# EAGLE design PointhiBoard (EAGLE 6.5.0)
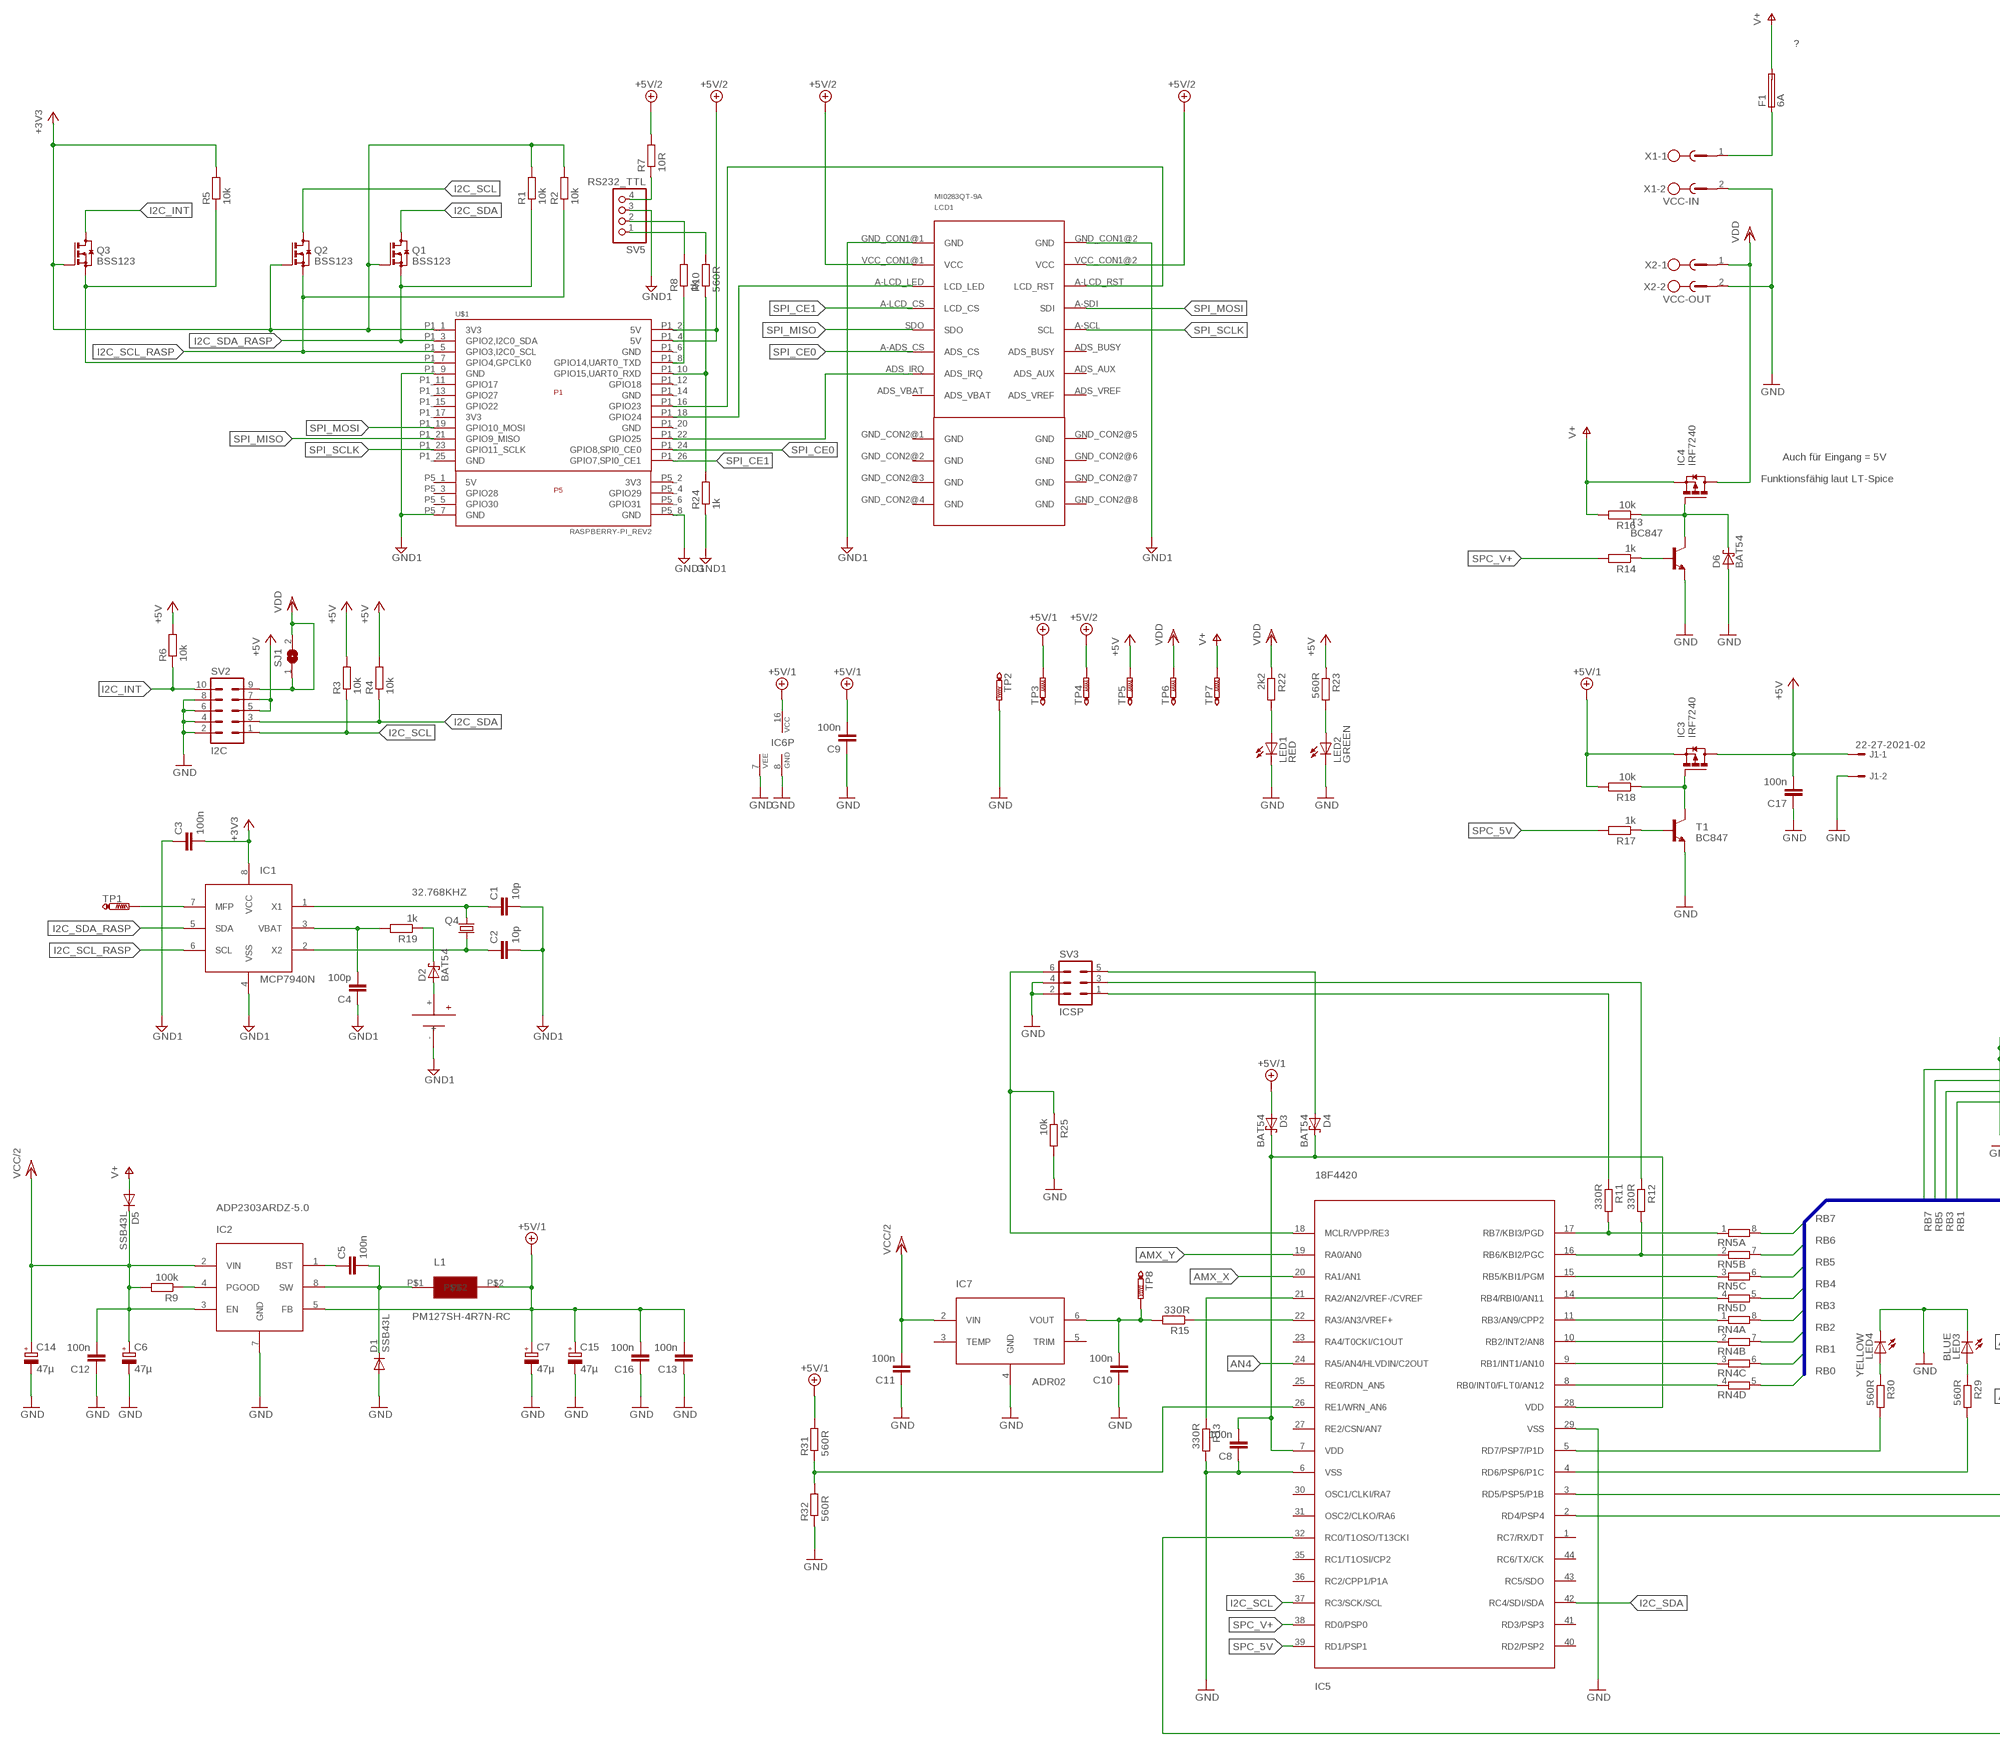
[diagram p0: schematic, sheet 1, part 1 of 2]
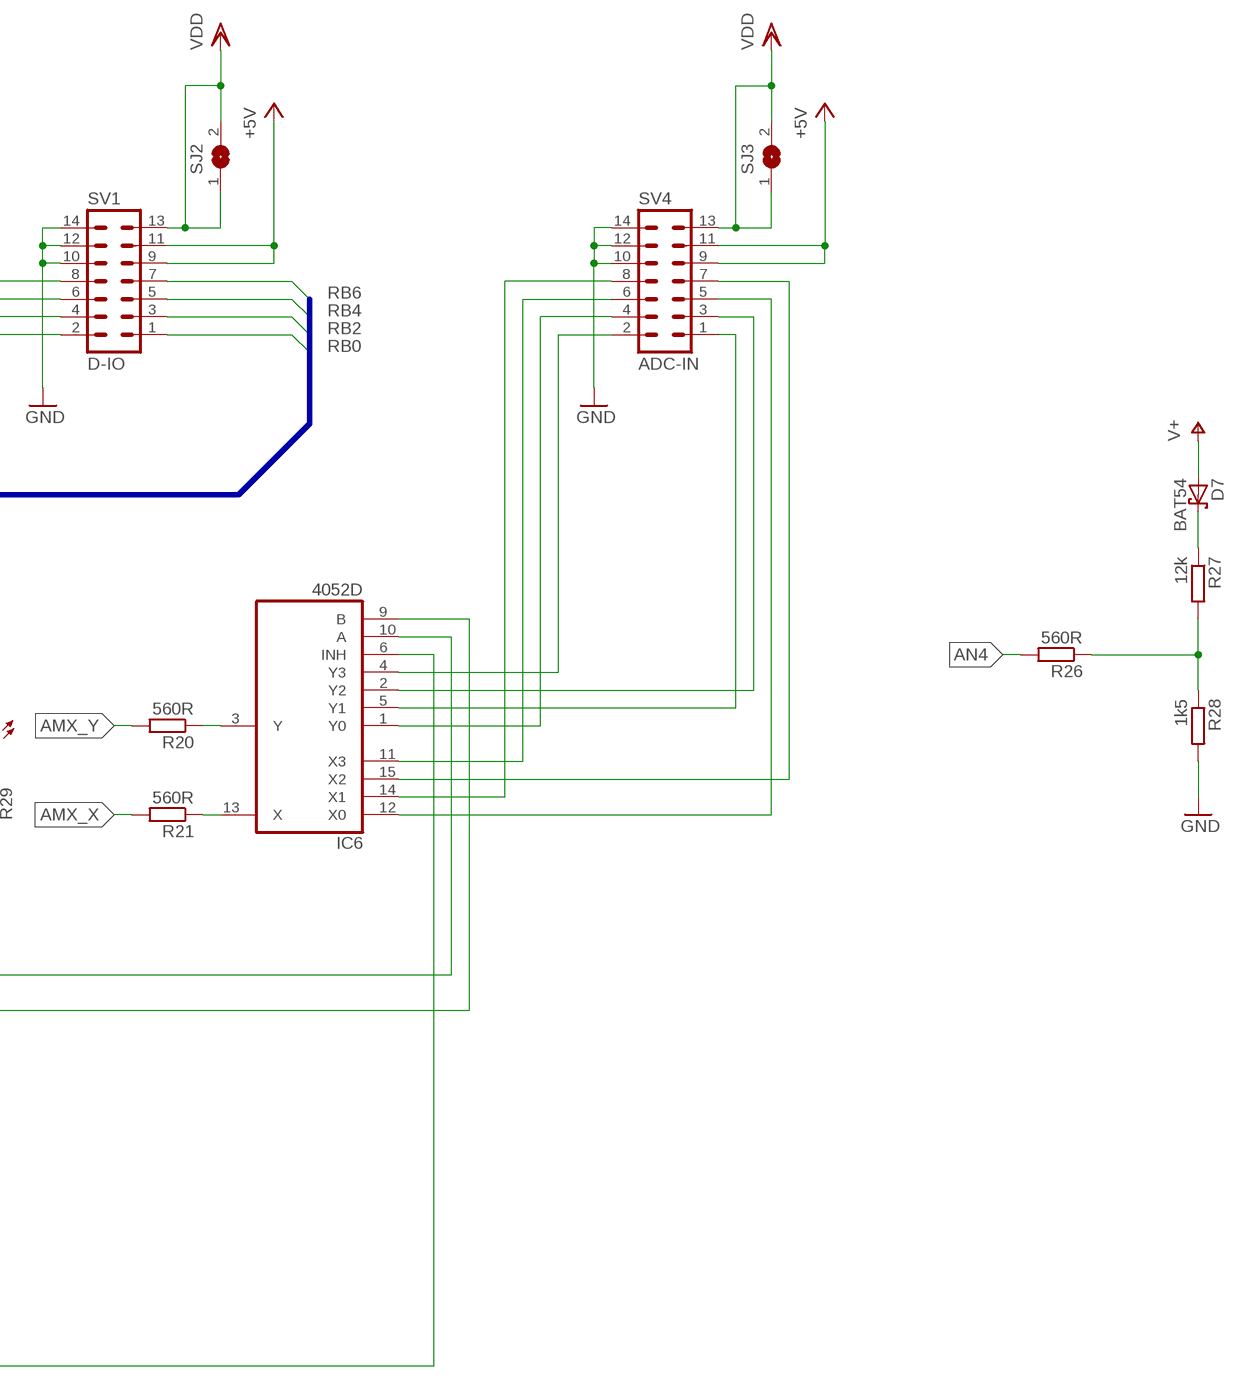
[diagram p1: schematic, sheet 1, part 2 of 2]

## Parts
BAT1  CH25-2032LF  [CH25-2032LF]
C1  10p  C-EUC0805  [C0805]
C2  10p  C-EUC0805  [C0805]
C3  100n  C-EUC0805  [C0805]
C4  100p  C-EUC0805  [C0805]
C5  100n  C-EUC0805  [C0805]
C6  47µ  CPOL-EUD  [PANASONIC_D]
C7  47µ  CPOL-EUD  [PANASONIC_D]
C8  100n  C-EUC0805  [C0805]
C9  100n  C-EUC0805  [C0805]
C10  100n  C-EUC0805  [C0805]
C11  100n  C-EUC0805  [C0805]
C12  100n  C-EUC0805  [C0805]
C13  100n  C-EUC0805  [C0805]
C14  47µ  CPOL-EUD  [PANASONIC_D]
C15  47µ  CPOL-EUD  [PANASONIC_D]
C16  100n  C-EUC0805  [C0805]
C17  100n  C-EUC0805  [C0805]
D1  SSB43L  DIODE-DO214AA  [DO214AA]
D2  BAT54  [SOT23]
D3  BAT54  [SOT23]
D4  BAT54  [SOT23]
D5  SSB43L  DIODE-DO214AA  [DO214AA]
D6  BAT54  [SOT23]
D7  BAT54  [SOT23]
F1  6A  FUSESHK20L  [SHK20L]
IC1  MCP7940N  MCP7940NMSOP8  [MSOP8]
IC2  ADP2303ARDZ-5.0  [SOIC8]
IC3  IRF7240  [SOIC8]
IC4  IRF7240  [SOIC8]
IC5  18F4420  PIC18F4420  [TQFP44]
IC6  4052D  [SO16]
IC7  ADR02  ADR0X  [SOIC8]
J1  22-27-2021-02  [6410-02]
L1  PM127SH-4R7N-RC  PM127SH  [PM127SH]
LCD1  MI0283QT-9A  MI0283QT_9A  [MI0283QT-9A]
LED1  RED  LEDCHIP-LED0805  [CHIP-LED0805]
LED2  GREEN  LEDCHIP-LED0805  [CHIP-LED0805]
LED3  BLUE  LEDCHIP-LED0805  [CHIP-LED0805]
LED4  YELLOW  LEDCHIP-LED0805  [CHIP-LED0805]
Q1  BSS123  [SOT23]
Q2  BSS123  [SOT23]
Q3  BSS123  [SOT23]
Q4  32.768KHZ  CRYSTALMM20SS  [MM20SS]
R1  10k  R-EU_R0805  [R0805]
R2  10k  R-EU_R0805  [R0805]
R3  10k  R-EU_R0805  [R0805]
R4  10k  R-EU_R0805  [R0805]
R5  10k  R-EU_R0805  [R0805]
R6  10k  R-EU_R0805  [R0805]
R7  10R  R-EU_R0805  [R0805]
R8  1k  R-EU_R0805  [R0805]
R9  100k  R-EU_R0805  [R0805]
R10  560R  R-EU_R0805  [R0805]
R11  330R  R-EU_R0805  [R0805]
R12  330R  R-EU_R0805  [R0805]
R13  330R  R-EU_R0805  [R0805]
R14  1k  R-EU_R0805  [R0805]
R15  330R  R-EU_R0805  [R0805]
R16  10k  R-EU_R0805  [R0805]
R17  1k  R-EU_R0805  [R0805]
R18  10k  R-EU_R0805  [R0805]
R19  1k  R-EU_R0805  [R0805]
R20  560R  R-EU_R0805  [R0805]
R21  560R  R-EU_R0805  [R0805]
R22  2k2  R-EU_R0805  [R0805]
R23  560R  R-EU_R0805  [R0805]
R24  1k  R-EU_R0805  [R0805]
R25  10k  R-EU_R0805  [R0805]
R26  560R  R-EU_R0805  [R0805]
R27  12k  R-EU_R0805  [R0805]
R28  1k5  R-EU_R0805  [R0805]
R29  560R  R-EU_R0805  [R0805]
R30  560R  R-EU_R0805  [R0805]
R31  560R  R-EU_R0805  [R0805]
R32  560R  R-EU_R0805  [R0805]
RN4  4R-NEXB38V  [EXB38V]
RN5  4R-NEXB38V  [EXB38V]
SJ1  SJ  [SJ]
SJ2  SJ  [SJ]
SJ3  SJ  [SJ]
SV1  D-IO  ML14-3ML  [3M_14L]
SV2  I2C  ML10-3ML  [3M_10L]
SV3  ICSP  ML6  [ML6]
SV4  ADC-IN  ML14-3ML  [3M_14L]
SV5  RS232_TTL  PINHD-1X4  [1X04]
T1  BC847  [SOT23]
T3  BC847  [SOT23]
TP1  PTR1B2,54  [B2,54]
TP2  PTR1B2,54  [B2,54]
TP3  PTR1B2,54  [B2,54]
TP4  PTR1B2,54  [B2,54]
TP5  PTR1B2,54  [B2,54]
TP6  PTR1B2,54  [B2,54]
TP7  PTR1B2,54  [B2,54]
TP8  PTR1B2,54  [B2,54]
U$1  RASPBERRY-PI_REV2  [RASPBERRY-PI_REV2]
X1  VCC-IN  MSTBV2  [MSTBV2]
X2  VCC-OUT  MSTBV2  [MSTBV2]

## Nets
+3V3: C3.2 IC1.8(VCC) Q1.1(G) Q2.1(G) Q3.1(G) R1.2 R2.2 R5.2 U$1.P1_1(3V3)
+5V: C17.2 IC3.5(D) IC3.6(D) IC3.7(D) IC3.8(D) J1.1 R3.2 R4.2 R6.2 R23.1 SV1.9 SV1.11 SV2.5 SV2.7 SV4.9 SV4.11 TP5.TP
+5V/1: C7.+ C9.2 C13.2 C15.+ C16.2 D3.1(A) IC2.5(FB) IC3.1(S) IC3.2(S) IC3.3(S) IC6.16(VCC) L1.P$2 R18.2 R31.2 TP3.TP
+5V/2: LCD1.VCC_CON1@1(VCC) LCD1.VCC_CON1@2(VCC) R7.2 TP4.TP U$1.P1_2(5V) U$1.P1_4(5V)
AMX_X: IC5.20(RA1/AN1) R21.2
AMX_Y: IC5.19(RA0/AN0) R20.2
AN4: IC5.24(RA5/AN4/HLVDIN/C2OUT) R26.2
GND: C6.- C7.- C8.1 C9.1 C10.1 C11.1 C12.1 C13.1 C14.- C15.- C16.1 C17.1 D1.A D6.1(A) IC2.7(GND) IC5.6(VSS) IC5.29(VSS) IC6.7(VEE) IC6.8(GND) IC7.4(GND) J1.2 LED1.C LED2.C LED3.C LED4.C R13.2 R25.2 R28.2 R32.1 SV1.10 SV1.12 SV1.14 SV2.2 SV2.4 SV2.6 SV2.8 SV3.2 SV3.4 SV4.10 SV4.12 SV4.14 T1.2(E) T3.2(E) TP2.TP X1.2 X2.2
GND1: BAT1.- C1.2 C2.2 C3.1 C4.1 IC1.4(VSS) LCD1.GND_CON1@1(GND) LCD1.GND_CON1@2(GND) R24.1 SV5.3 U$1.P1_9(GND) U$1.P5_7(GND) U$1.P5_8(GND)
I2C_INT: Q3.3(D) R6.1 SV2.10
I2C_SCL: IC5.37(RC3/SCK/SCL) Q2.3(D) R3.1 SV2.1
I2C_SCL_RASP: IC1.6(SCL) Q2.2(S) R2.1 U$1.P1_5(GPIO3,I2C0_SCL)
I2C_SDA: IC5.42(RC4/SDI/SDA) Q1.3(D) R4.1 SV2.3
I2C_SDA_RASP: IC1.5(SDA) Q1.2(S) R1.1 U$1.P1_3(GPIO2,I2C0_SDA)
MCLR: IC5.18(MCLR/VPP/RE3) R25.1 SV3.6
N$2: Q3.2(S) R5.1 U$1.P1_7(GPIO4,GPCLK0)
N$5: LCD1.A-LCD_LED(LCD_LED) U$1.P1_18(GPIO24)
N$6: LCD1.A-LCD_RST(LCD_RST) U$1.P1_16(GPIO23)
N$7: LCD1.ADS_IRQ U$1.P1_22(GPIO25)
N$8: R7.1 SV5.4
N$9: R8.1 U$1.P1_8(GPIO14,UART0_TXD)
N$10: R8.2 SV5.2
N$11: C5.2 D1.C IC2.8(SW) L1.P$1
N$12: C8.2 D3.3(C) D4.3(C) IC5.7(VDD) IC5.28(VDD)
N$13: C5.1 IC2.1(BST)
N$14: IC2.4(PGOOD) R9.1
N$15: IC5.17(RB7/KBI3/PGD) R11.2 RN5.1
N$16: IC5.16(RB6/KBI2/PGC) R12.2 RN5.2
N$17: C1.1 IC1.1(X1) Q4.1
N$18: C2.1 IC1.2(X2) Q4.4
N$19: D6.3(C) IC4.4(G) R16.1 T3.3(C)
N$20: R14.1 T3.1(B)
N$21: IC1.7(MFP) TP1.TP
N$22: IC5.15(RB5/KBI1/PGM) RN5.3
N$23: IC3.4(G) R18.1 T1.3(C)
N$24: R17.1 T1.1(B)
N$25: IC5.14(RB4/RBI0/AN11) RN5.4
N$26: IC5.11(RB3/AN9/CPP2) RN4.1
N$27: F1.1A X1.1
N$28: IC5.10(RB2/INT2/AN8) RN4.2
N$29: IC5.9(RB1/INT1/AN10) RN4.3
N$30: IC5.8(RB0/INT0/FLT0/AN12) RN4.4
N$31: D4.1(A) SV3.5
N$32: C4.2 IC1.3(VBAT) R19.2
N$33: BAT1.+ D2.1(A)
N$34: D2.3(C) R19.1
N$35: D7.3(C) R27.1
N$36: R11.1 SV3.1
N$37: R12.1 SV3.3
N$38: IC6.1(Y0) SV4.4
N$39: IC6.2(Y2) SV4.3
N$40: IC6.4(Y3) SV4.2
N$41: IC6.5(Y1) SV4.1
N$42: IC6.15(X2) SV4.7
N$43: IC6.14(X1) SV4.8
N$44: IC6.12(X0) SV4.5
N$45: IC6.11(X3) SV4.6
N$46: IC5.3(RD5/PSP5/P1B) IC6.10(A)
N$47: IC5.2(RD4/PSP4) IC6.9(B)
N$48: IC5.32(RC0/T1OSO/T13CKI) IC6.6(INH)
N$49: C10.2 IC7.6(VOUT) R15.2 TP8.TP
N$50: IC5.22(RA3/AN3/VREF+) R15.1
N$51: IC5.21(RA2/AN2/VREF-/CVREF) R13.1
N$52: IC6.13(X) R21.1
N$53: IC6.3(Y) R20.1
N$54: LED1.A R22.2
N$55: LED2.A R23.2
N$56: R10.1 R24.2 U$1.P1_10(GPIO15,UART0_RXD)
N$57: R10.2 SV5.1
N$58: R26.1 R27.2 R28.1
N$59: IC5.4(RD6/PSP6/P1C) R29.2
N$60: IC5.26(RE1/WRN_AN6) R31.1 R32.2
N$61: IC5.5(RD7/PSP7/P1D) R30.2
N$62: LED3.A R29.1
N$63: LED4.A R30.1
RB0: RN4.5 SV1.1
RB1: RN4.6 SV1.2
RB2: RN4.7 SV1.3
RB3: RN4.8 SV1.4
RB4: RN5.5 SV1.5
RB5: RN5.6 SV1.6
RB6: RN5.7 SV1.7
RB7: RN5.8 SV1.8
SPC_5V: IC5.39(RD1/PSP1) R17.2
SPC_V+: IC5.38(RD0/PSP0) R14.2
SPI_CE0: LCD1.A-ADS_CS(ADS_CS) U$1.P1_24(GPIO8,SPI0_CE0)
SPI_CE1: LCD1.A-LCD_CS(LCD_CS) U$1.P1_26(GPIO7,SPI0_CE1)
SPI_MISO: LCD1.SDO U$1.P1_21(GPIO9_MISO)
SPI_MOSI: LCD1.A-SDI(SDI) U$1.P1_19(GPIO10_MOSI)
SPI_SCLK: LCD1.A-SCL(SCL) U$1.P1_23(GPIO11_SCLK)
V+: D5.A D7.1(A) F1.2A IC4.1(S) IC4.2(S) IC4.3(S) R16.2 TP7.TP
VCC/2: C6.+ C11.2 C12.2 C14.+ D5.C IC2.2(VIN) IC2.3(EN) IC7.2(VIN) R9.2
VDD: IC4.5(D) IC4.6(D) IC4.7(D) IC4.8(D) R22.1 SJ1.1 SJ1.2 SJ2.1 SJ2.2 SJ3.1 SJ3.2 SV1.13 SV2.9 SV4.13 TP6.TP X2.1
Unconnected: IC5.1(RC7/RX/DT) IC5.23(RA4/T0CKI/C1OUT) IC5.25(RE0/RDN_AN5) IC5.27(RE2/CSN/AN7) IC5.30(OSC1/CLKI/RA7) IC5.31(OSC2/CLKO/RA6) IC5.35(RC1/T1OSI/CP2) IC5.36(RC2/CPP1/P1A) IC5.40(RD2/PSP2) IC5.41(RD3/PSP3) IC5.43(RC5/SDO) IC5.44(RC6/TX/CK) IC7.3(TEMP) IC7.5(TRIM) LCD1.ADS_AUX LCD1.ADS_BUSY LCD1.ADS_VBAT LCD1.ADS_VREF LCD1.GND_CON2@1(GND) LCD1.GND_CON2@2(GND) LCD1.GND_CON2@3(GND) LCD1.GND_CON2@4(GND) LCD1.GND_CON2@5(GND) LCD1.GND_CON2@6(GND) LCD1.GND_CON2@7(GND) LCD1.GND_CON2@8(GND) U$1.P1_6(GND) U$1.P1_11(GPIO17) U$1.P1_12(GPIO18) U$1.P1_13(GPIO27) U$1.P1_14(GND) U$1.P1_15(GPIO22) U$1.P1_17(3V3) U$1.P1_20(GND) U$1.P1_25(GND) U$1.P5_1(5V) U$1.P5_2(3V3) U$1.P5_3(GPIO28) U$1.P5_4(GPIO29) U$1.P5_5(GPIO30) U$1.P5_6(GPIO31)

## Buses
RB0,RB1,RB2,RB3,RB4,RB5,RB6,RB7

## Notes on the sheet
- ?
- Auch für Eingang = 5V
- Funktionsfähig laut LT-Spice

## Library data of the parts
BAT1 = libsRobocup:CH25-2032LF: 20mm Lithium Battery Holder
C1-C5 C8-C13 C16 C17 = resistor:C-EU: CAPACITOR, European symbol
C6 C7 C14 C15 = resistor:CPOL-EU: POLARIZED CAPACITOR, European symbol
D1 D5 = diode:DIODE-: DIODE
D2-D4 D6 D7 = diode:BAT54: Schottky Diodes Source: Fairchild .. BAT54.pdf
F1 = fuse:FUSE: Fuse; OC_FARNELL: unknown; OC_NEWARK: unknown
IC1 = libsRobocup:MCP7940N: Low-Cost I²C Real-Time Clock/Calendar with SRAM
IC2 = libsRobocup:ADP2303ARDZ-5.0
IC3 IC4 = Robocup:IRF7240
IC5 = libsRobocup:PIC18F4420
IC6 = 40xx:4052: Dual 4-channel ANALOG MULTIPLEXER
IC7 = libsRobocup:ADR0X: High Precision Voltage Reference
J1 = con-molex:22-?-02: CONNECTOR wire to board 2.54 mm (.1 inch) pitch header; OC_FARNELL: unknown; OC_NEWARK: unknown
L1 = libsRobocup:PM127SH
LCD1 = Robocup:MI0283QT_9A
LED1-LED4 = led:LED: LED OSRAM: - CHIPLED LG R971, LG N971, LY N971, LG Q971, LY Q971, LO R971, LY R971 LH N974, LH R974 LS Q976, LO Q976, LY Q976 LO Q996 - Hyper CHIPLED LW Q18S LB Q993, LB Q99A, LB R99A - SideLED LS A670, LO A670, LY A670, LG A670, LP A670 LB A673, LV A673, LT A673, LW A673 LH A674 LY A675 LS A676, LA A676, LO A676, LY A676, LW A676 LS A679, LY A679, LG A679 - Hyper Micro SIDELED® LS Y876, LA Y876, LO Y876, LY Y876 LT Y87S - SmartLED LW L88C, LW L88S LB L89C, LB L89S, LG L890 LS L89K, LO L89K, LY L89K LS L896, LA L896, LO L896, LY L896 - TOPLED LS T670, LO T670, LY T670, LG T670, LP T670 LSG T670, LSP T670, LSY T670, LOP T670, LYG T670 LG T671, LOG T671, LSG T671 LB T673, LV T673, LT T673, LW T673 LH T674 LS T676, LA T676, LO T676, LY T676, LB T676, LH T676, LSB T676, LW T676 LB T67C, LV T67C, LT T67C, LS T67K, LO T67K, LY T67K, LW E67C LS E67B, LA E67B, LO E67B, LY E67B, LB E67C, LV E67C, LT E67C LW T67C LS T679, LY T679, LG T679 LS T770, LO T770, LY T770, LG T770, LP T770 LB T773, LV T773, LT T773, LW T773 LH T774 LS E675, LA E675, LY E675, LS T675 LS T776, LA T776, LO T776, LY T776, LB T776 LHGB T686 LT T68C, LB T68C - Hyper Mini TOPLED® LB M676 - Mini TOPLED Santana® LG M470 LS M47K, LO M47K, LY M47K Source: http://www.osram.convergy.de LUXEON: - LUMILED® LXK2-PW12-R00, LXK2-PW12-S00, LXK2-PW14-U00, LXK2-PW14-V00 LXK2-PM12-R00, LXK2-PM12-S00, LXK2-PM14-U00 LXK2-PE12-Q00, LXK2-PE12-R00, LXK2-PE12-S00, LXK2-PE14-T00, LXK2-PE14-U00 LXK2-PB12-K00, LXK2-PB12-L00, LXK2-PB12-M00, LXK2-PB14-N00, LXK2-PB14-P00, LXK2-PB14-Q00 LXK2-PR12-L00, LXK2-PR12-M00, LXK2-PR14-Q00, LXK2-PR14-R00 LXK2-PD12-Q00, LXK2-PD12-R00, LXK2-PD12-S00 LXK2-PH12-R00, LXK2-PH12-S00 LXK2-PL12-P00, LXK2-PL12-Q00, LXK2-PL12-R00 Source: www.luxeon.com KINGBRIGHT: KA-3528ASYC Source: www.kingbright.com
Q1-Q3 = transistor-small-signal:BSS123: N-CHANNEL MOS FET
Q4 = crystal:CRYSTAL: CRYSTAL; OC_FARNELL: unknown; OC_NEWARK: unknown
R1-R32 = resistor:R-EU_: RESISTOR, European symbol
RN4 RN5 = resistor-dil:4R-N: Array Chip Resistor Source: RS Component / Phycomp; OC_FARNELL: unknown; OC_NEWARK: unknown
SJ1-SJ3 = jumper:SJ: SMD solder JUMPER
SV1 SV4 = con-harting-ml-mod:ML14: HARTING; OC_FARNELL: unknown; OC_NEWARK: unknown
SV2 = con-harting-ml-mod:ML10: HARTING; OC_FARNELL: unknown; OC_NEWARK: unknown
SV3 = con-harting-ml:ML6: HARTING; OC_FARNELL: unknown; OC_NEWARK: unknown
SV5 = pinhead:PINHD-1X4: PIN HEADER
T1 T3 = transistor:BC847: NPN TRANSISTOR
TP1-TP8 = testpad:PTR1: TEST PIN
U$1 = RaspberryPi:RASPBERRY-PI_REV2: Raspberry Pi Board <http://www.raspberrypi.org/> Jacques Lagnel V1.0 (beta) 2012 Mateusz Bawaj V1.1 (beta) 2012 Board dimension: Forum 3D model <http://www.raspberrypi.org/forum/general-discussion/mechanical-profile-3d-models?value=3d%20model&type=1&include=1&search=1&ret=all> The GPIO Connector (P1): http://elinux.org/RPi_Low-level_peripherals The GPIO Connector (P5): http://www.raspberrypi-spy.co.uk/2012/09/raspberry-pi-p5-header/
X1 X2 = con-phoenix-500:MSTBV2: PHOENIX; OC_FARNELL: unknown; OC_NEWARK: unknown

## Board
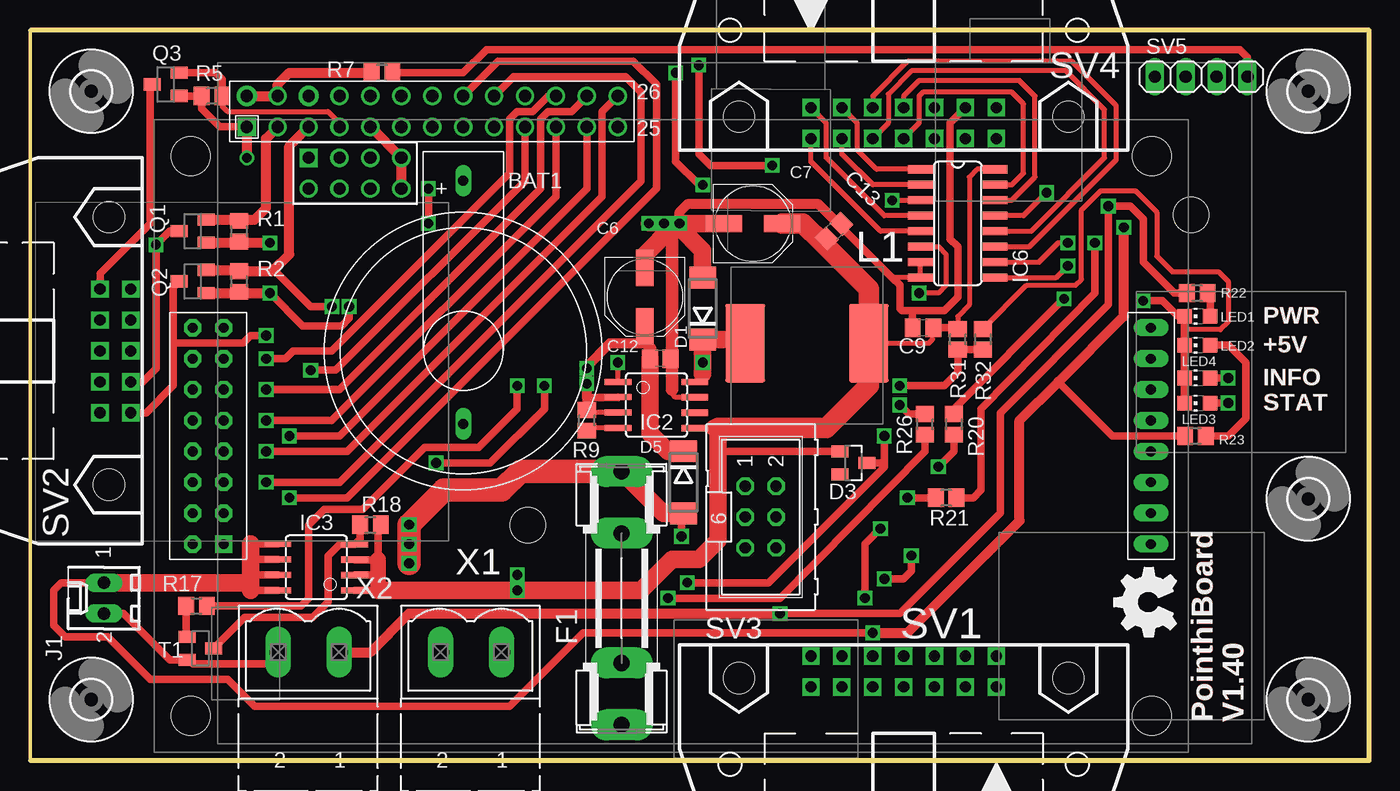
[diagram p2: board, top side]
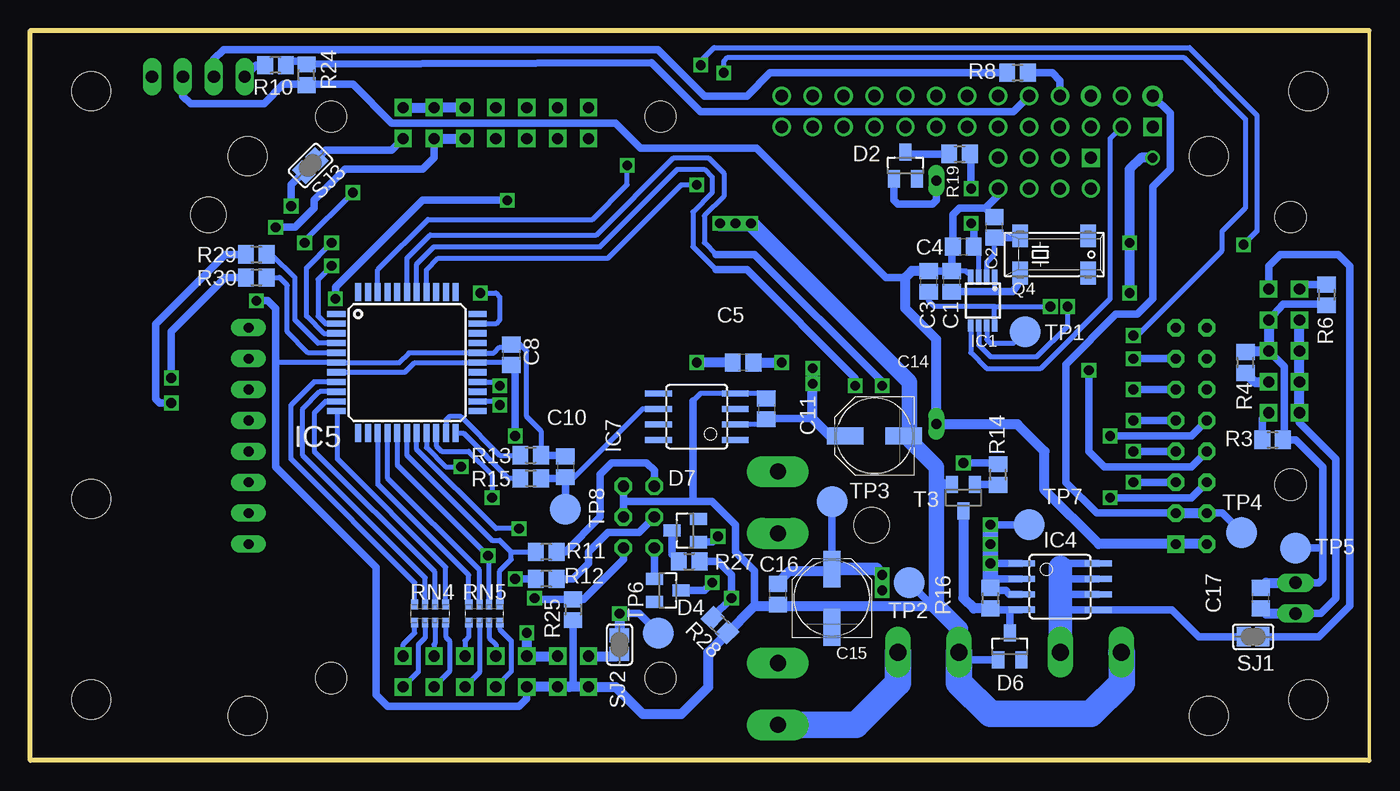
[diagram p3: board, bottom side, seen from below]

Size 110 x 60 mm. Coordinates in mm from the lower left corner, seen from the top.
Outline: 0,0 110,0 110,60 0,60 0,0
Copper layers (1*16): Top 0.035mm / dielectric 1.5mm / Bottom 0.035mm
Design rules "default *": minimum track width 10mil, minimum drill 24mil, track to track 8mil, track to pad 8mil, pad to pad 8mil, via to via 8mil, smd to smd 8mil, copper to edge 40mil, drill to drill 8mil, minimum pad ring 10mil, minimum via ring 8mil, stop-mask expansion 4mil, vias tented up to drill 0mil, thermal gap 10mil

### Footprints (pad centres in the part's own frame; a part is rotated, then mirrored left to right if it is on the bottom)
CH25-2032LF = drill 0.8 long: + 0,-14; - 0,6
C0805 = smd 1.3 x 1.5: 1 -0.85,0; 2 0.85,0
PANASONIC_D = smd 3 x 1.4: + 2.4,0; - -2.4,0
DO214AA = smd 1.8 x 2.2: A 2.55,0; C -2.55,0
SOT23 = smd 1 x 1.4: 1 -0.95,-1.1; 2 0.95,-1.1; 3 0,1.1
SHK20L = drill 1.321 pad 2.54 long: 1A -10.414,0; 1B -5.334,0; 2A 10.414,0; 2B 5.334,0
MSOP8 = smd 0.45 x 1: 1 -0.975,-2.05; 2 -0.325,-2.05; 3 0.325,-2.05; 4 0.975,-2.05; 5 0.975,2.05; 6 0.325,2.05; 7 -0.325,2.05; 8 -0.975,2.05
SOIC8 = smd 0.5 x 2.2: 1 -1.905,-3.154; 2 -0.645,-3.154; 3 0.625,-3.154; 4 1.895,-3.154; 5 1.905,3.154; 6 0.635,3.154; 7 -0.635,3.154; 8 -1.905,3.154
TQFP44 = smd 1.5 x 0.5: 1 -5.8,4; 2 -5.8,3.2; 3 -5.8,2.4; 4 -5.8,1.6; 5 -5.8,0.8; 6 -5.8,0; 7 -5.8,-0.8; 8 -5.8,-1.6; 9 -5.8,-2.4; 10 -5.8,-3.2; 11 -5.8,-4; 23 5.8,-4; 24 5.8,-3.2; 25 5.8,-2.4; 26 5.8,-1.6; 27 5.8,-0.8; 28 5.8,0; 29 5.8,0.8; 30 5.8,1.6; 31 5.8,2.4; 32 5.8,3.2; 33 5.8,4 | smd 0.5 x 1.5: 12 -4,-5.8; 13 -3.2,-5.8; 14 -2.4,-5.8; 15 -1.6,-5.8; 16 -0.8,-5.8; 17 0,-5.8; 18 0.8,-5.8; 19 1.6,-5.8; 20 2.4,-5.8; 21 3.2,-5.8; 22 4,-5.8; 34 4,5.8; 35 3.2,5.8; 36 2.4,5.8; 37 1.6,5.8; 38 0.8,5.8; 39 0,5.8; 40 -0.8,5.8; 41 -1.6,5.8; 42 -2.4,5.8; 43 -3.2,5.8; 44 -4,5.8
SO16 = smd 0.66 x 2.032: 1 -4.445,-3.073; 2 -3.175,-3.073; 3 -1.905,-3.073; 4 -0.635,-3.073; 5 0.635,-3.073; 6 1.905,-3.073; 7 3.175,-3.073; 8 4.445,-3.073; 9 4.445,3.073; 10 3.175,3.073; 11 1.905,3.073; 12 0.635,3.073; 13 -0.635,3.073; 14 -1.905,3.073; 15 -3.175,3.073; 16 -4.445,3.073
6410-02 = drill 1.016 long: 1 1.27,0; 2 -1.27,0
PM127SH = smd 3.251 x 6.452: P$1 5.08,0; P$2 -5.08,0
MI0283QT-9A = drill 0.8 pad 1.422 octagon: A-ADS_CS -3.81,5.715; A-LCD_CS 1.27,5.715; A-LCD_LED 3.81,5.715; A-LCD_RST 3.81,3.175; A-SCL -1.27,3.175; A-SDI 1.27,3.175; ADS_AUX -6.35,3.175; ADS_BUSY -3.81,3.175; ADS_IRQ -6.35,5.715; ADS_VBAT -8.89,5.715; ADS_VREF -8.89,3.175; GND_CON1@2 8.89,3.175; SDO -1.27,5.715; VCC_CON1@1 6.35,5.715; VCC_CON1@2 6.35,3.175 | drill 0.8 pad 1.422 square: GND_CON1@1 8.89,5.715 | drill 0.8 pad 1.422 long: GND_CON2@1 8.89,81.915; GND_CON2@2 6.35,81.915; GND_CON2@3 3.81,81.915; GND_CON2@4 1.27,81.915; GND_CON2@5 -1.27,81.915; GND_CON2@6 -3.81,81.915; GND_CON2@7 -6.35,81.915; GND_CON2@8 -8.89,81.915 | hole 3.2: -23,3; 23,3; -23,82; 23,82
CHIP-LED0805 = smd 1.2 x 1.2: A 0,-1.05; C 0,1.05
MM20SS = smd 1.27 x 1.88: 1 -2.794,-1.524; 2 2.794,-1.524; 3 2.794,1.524; 4 -2.794,1.524
R0805 = smd 1.3 x 1.5: 1 -0.85,0; 2 0.85,0
EXB38V = smd 0.6 x 0.8: 1 -1.275,-0.75; 4 1.275,-0.75; 5 1.275,0.75; 8 -1.275,0.75 | smd 0.5 x 0.8: 2 -0.4,-0.75; 3 0.4,-0.75; 6 0.4,0.75; 7 -0.4,0.75
SJ = smd 1.168 x 1.6: 1 -0.762,0; 2 0.762,0
3M_14L = drill 0.914 square: 1 -7.62,-5.08; 2 -7.62,-2.54; 3 -5.08,-5.08; 4 -5.08,-2.54; 5 -2.54,-5.08; 6 -2.54,-2.54; 7 0,-5.08; 8 0,-2.54; 9 2.54,-5.08; 10 2.54,-2.54; 11 5.08,-5.08; 12 5.08,-2.54; 13 7.62,-5.08; 14 7.62,-2.54 | hole 2.54: -13.538,-3.277; 13.538,-3.277
3M_10L = drill 0.914 square: 1 -5.08,-5.08; 2 -5.08,-2.54; 3 -2.54,-5.08; 4 -2.54,-2.54; 5 0,-5.08; 6 0,-2.54; 7 2.54,-5.08; 8 2.54,-2.54; 9 5.08,-5.08; 10 5.08,-2.54 | hole 2.54: -10.998,-3.277; 10.998,-3.277
ML6 = drill 0.914 octagon: 1 -2.54,-1.27; 2 -2.54,1.27; 3 0,-1.27; 4 0,1.27; 5 2.54,-1.27; 6 2.54,1.27
1X04 = drill 1.016 long: 1 -3.81,0; 2 -1.27,0; 3 1.27,0; 4 3.81,0
B2,54 = smd 2.54 x 2.54: TP 0,0
RASPBERRY-PI_REV2 = drill 1 square: P1_1 -41.91,21.59; P5_1 -36.83,19.05 | drill 1 pad 1.676: P1_2 -41.91,24.13; P1_6 -36.83,24.13 | drill 1: P1_3 -39.37,21.59; P1_4 -39.37,24.13; P1_5 -36.83,21.59; P1_7 -34.29,21.59; P1_8 -34.29,24.13; P1_9 -31.75,21.59; P1_10 -31.75,24.13; P1_11 -29.21,21.59; P1_12 -29.21,24.13; P1_13 -26.67,21.59; P1_14 -26.67,24.13; P1_15 -24.13,21.59; P1_16 -24.13,24.13; P1_17 -21.59,21.59; P1_18 -21.59,24.13; P1_19 -19.05,21.59; P1_20 -19.05,24.13; P1_21 -16.51,21.59; P1_22 -16.51,24.13; P1_23 -13.97,21.59; P1_24 -13.97,24.13; P1_25 -11.43,21.59; P1_26 -11.43,24.13; P5_2 -36.83,16.51; P5_3 -34.29,19.05; P5_4 -34.29,16.51; P5_5 -31.75,19.05; P5_6 -31.75,16.51; P5_7 -29.21,19.05; P5_8 -29.21,16.51 | hole 2.9: 35.69,14.365; -18.81,-11.135
3,2 = hole 3.2: 0,0
MSTBV2 = drill 1.397 long: 1 -2.5,0; 2 2.5,0

### Placement (x,y rotation side)
BAT1  35.56,33.66 180 top
C1  34.29,39.37 90 bottom
C2  30.8,43.81 90 bottom
C3  36.2,39.37 270 bottom
C4  33.34,42.23 0 bottom
C5  51.44,32.7 180 bottom
C6  50.48,38.1 270 top
C7  59.37,44.13 0 top
C8  70.48,33.34 270 bottom
C9  73.34,35.56 0 top
C10  66.04,24.13 270 bottom
C11  49.53,28.89 270 bottom
C12  51.75,33.02 180 top
C13  66.04,43.5 225 top
C14  40.64,26.67 180 bottom
C15  44.13,13.34 90 bottom
C16  48.58,13.65 90 bottom
C17  8.89,13.34 90 bottom
D1  55.24,37.15 90 top
D2  38.1,48.9 0 bottom
D3  67.63,24.45 270 top
D4  57.63,13.97 270 bottom
D5  53.66,22.86 270 top
D6  29.53,9.37 0 bottom
D7  56.2,18.89 90 bottom
F1  48.58,13.34 90 top
IC1  31.75,37.78 180 bottom
IC2  51.44,29.21 270 top
IC3  23.5,15.88 90 top
IC4  25.4,14.29 270 bottom
IC5  79.06,32.7 0 bottom
IC6  76.2,44.13 270 top
IC7  55.24,28.26 90 bottom
J1  6.03,13.34 90 top
L1  63.82,34.29 180 top
LCD1  10.16,26.67 270 top
LED1  95.89,36.51 90 top
LED2  95.89,34.13 90 top
LED3  95.89,29.37 90 top
LED4  95.89,31.43 90 top
Q1  13.34,43.5 90 top
Q2  13.34,39.37 90 top
Q3  11.11,55.56 90 top
Q4  25.88,41.59 0 bottom
R1  17.14,43.5 270 top
R2  17.14,39.37 270 top
R3  7.94,26.35 0 bottom
R4  10.16,32.7 90 bottom
R5  14.92,54.61 180 top
R6  3.49,38.26 270 bottom
R7  28.89,56.52 180 top
R8  28.89,56.52 180 bottom
R9  45.72,27.94 90 top
R10  89.85,57.15 180 bottom
R11  67.63,17.14 180 bottom
R12  67.63,14.92 180 bottom
R13  68.9,25.08 0 bottom
R14  30.48,23.5 90 bottom
R15  68.9,23.18 0 bottom
R16  31.11,13.34 90 bottom
R17  13.65,12.7 0 top
R18  27.94,19.37 0 top
R19  33.66,49.85 0 bottom
R20  75.88,27.62 270 top
R21  75.25,21.59 180 top
R22  95.89,38.42 0 top
R23  95.73,26.67 0 top
R24  87.31,56.36 90 bottom
R25  65.41,12.38 270 bottom
R26  73.5,27.62 90 top
R27  55.88,16.35 0 bottom
R28  53.34,11.11 315 bottom
R29  91.44,41.59 0 bottom
R30  91.44,39.69 0 bottom
R31  76.2,34.61 90 top
R32  78.26,34.61 270 top
RN4  77.15,12.06 180 bottom
RN5  72.71,12.06 180 bottom
SJ1  9.53,10.16 0 bottom
SJ2  61.59,9.53 270 bottom
SJ3  87,48.9 225 bottom
SV1  71.75,3.49 180 top
SV2  3.17,33.66 90 top
SV3  60.01,20 270 top
SV4  71.75,56.2 0 top
SV5  96.2,56.2 0 top
T1  13.97,9.21 270 top
T3  33.34,21.59 180 bottom
TP1  28.26,35.24 0 bottom
TP2  37.78,14.61 0 bottom
TP3  44.13,21.27 0 bottom
TP4  10.48,18.73 0 bottom
TP5  6.03,17.46 0 bottom
TP6  58.42,10.48 0 bottom
TP7  27.94,19.37 0 bottom
TP8  66.04,20.64 0 bottom
U$1  59.69,30.48 0 top
U$2  [3,2]  5,5 0 top
U$3  [3,2]  5,55 0 top
U$4  [3,2]  105,55 0 top
U$5  [3,2]  105,5 0 top
U$6  [3,2]  105,21.5 0 top
U$7  [OSHW_FILLX200_NOTEXT]  94.14,10.16 90 top
X1  36.2,8.89 180 top
X2  22.86,8.89 180 top

### Tracks (layer width: path | path; a pad name or v marks a point on that pad's centre or on a via)
+3V3  (via drill 0.8)
  Top 0.61: 17.05,38.42 R2.2 | 17.05,42.55 R1.2 | U$1.P1_1 15.56,52.07 14.07,53.55 R5.2 Q3.1 | 19.68,38.26 v19.68,38.42 22.38,35.72 25.56,35.72 26.19,36.35 v26.19,37.31
  Top 0.813: Q1.1 17.14,42.55 R1.2 17.25,42.55 v19.68,42.55 | Q2.1 17.14,38.42 R2.2 17.25,38.42 v19.68,38.42 | U$1.P1_1 v17.78,49.53
  Bottom 0.406: IC1.8 30.77,37.31 | 30.77,37.31 v26.19,37.31 | 30.77,37.31 35.72,37.31 36.2,37.78 C3.2
  Bottom 0.813: v17.78,49.53 18.73,49.53 19.68,48.58 v19.68,42.55 v19.68,38.42
+5V  (via drill 0.8)
  Top 0.61: IC3.5 18.1,17.78 | IC3.6 18.1,16.51 | IC3.7 18.1,15.24 | IC3.8 18.1,13.97 | v69.22,10.48 45.4,10.48 39.37,4.45 18.41,4.45 16.19,6.67 9.84,6.67 6.35,10.16 2.86,10.16 1.91,11.11 1.91,13.97 2.54,14.61 J1.1 | 84.45,31.11 88.9,26.67 R23.1
  Top 0.813: v69.22,10.48 72.07,10.48 81.28,19.68 81.28,27.94 84.45,31.11 89.85,36.51 v89.85,43.81
  Top 1.422: 18.1,17.78 18.1,16.51 18.1,15.24 18.1,14.61 | 18.1,13.97 18.1,14.61 | 18.1,14.61 J1.1
  Bottom 0.61: R6.2 3.49,37.51 7.04,37.51 SV2.7 | SV4.11 76.83,49.53 77.79,48.58 84.14,48.58 86.68,46.04 86.68,45.4 88.27,43.81 v89.85,43.81 | 3.81,17.46 3.81,14.92 4.13,14.61 J1.1 | 3.81,17.46 3.81,24.13 6.03,26.35 R3.2 6.99,26.51 6.99,32.38 SV2.5 | TP5.TP 3.81,17.46
  Bottom 0.813: R4.2 10.06,33.66 SV2.5 SV2.7 | SV1.11 SV1.9 v69.22,10.48 | SV4.11 SV4.9 | C17.2 8.47,14.61 J1.1
+5V/1  (via drill 0.8)
  Top 0.406: IC2.5 56.2,27.3 | IC6.16 77.79,48.58 77.15,47.94 77.15,37.45 76.2,36.5 R31.2 | C13.2 65.09,42.58 65.09,42.55 | L1.P$2 73.82,34.29 74.14,34.61 74.14,35.5 C9.2
  Top 0.61: IC3.3 28.57,16.5 28.57,16.51 28.57,19.15 R18.2 | IC3.2 28.57,15.23 28.57,15.24 | IC3.1 28.57,13.97 | D3.1 56.51,25.4 56.52,27.3 | 40.01,14.29 39.69,13.97 | 33.66,14.29 33.34,13.97 | C9.2 76.1,35.56 R31.2
  Top 1.016: 40.01,14.29 v40.01,15.24
  Top 1.27: 28.57,16.51 28.57,15.24 28.57,13.97
  Top 1.422: 56.2,27.3 56.52,27.3 56.52,18.1 54.93,16.51 52.7,16.51 50.16,13.97 v40.01,13.97 39.69,13.97 33.34,13.97 28.57,13.97
  Top 1.676: C7.+ 63.5,44.13 65.09,42.55 68.9,38.73 L1.P$2 68.9,30.8 65.41,27.3 56.52,27.3
  Bottom 0.61: TP3.TP C15.+
  Bottom 0.813: C16.2 48.58,14.61 47.62,15.56 44.31,15.56 C15.+
  Bottom 1.016: C15.+ 40.46,15.73 40.46,15.7 v40.01,15.24 v40.01,13.97
+5V/2
  Top 0.813: U$1.P1_2 U$1.P1_4 20.32,55.56 21.27,56.52 R7.2
  Bottom 0.61: LCD1.VCC_CON1@1 22.38,20.32 24.92,22.86 24.92,32.54 20.8,36.67 19.05,36.67 17.78,37.94 17.78,47.15 16.35,48.58 16.35,53.18 U$1.P1_2 | LCD1.VCC_CON1@2 12.06,20.32 TP4.TP
  Bottom 0.813: LCD1.VCC_CON1@1 LCD1.VCC_CON1@2
AMX_X  (via drill 0.8)
  Top 0.61: v72.07,21.59 R21.2
  Bottom 0.406: IC5.20 76.66,25.86 76.2,25.4 73.98,25.4 72.07,23.5 v72.07,21.59
AMX_Y  (via drill 0.8)
  Top 0.61: R20.2 75.88,25.4 v74.61,24.13
  Bottom 0.406: IC5.19 77.46,25.7 75.88,24.13 v74.61,24.13
AN4  (via drill 0.8)
  Top 0.61: R26.2 72.17,28.47 v71.44,29.21
  Bottom 0.406: v71.44,29.21 71.73,29.5 IC5.24
GND  (via drill 0.8)
  Top 0.305: 94.83,35.98 94.83,35.4
  Top 0.406: IC2.7 53.02,29.84 52.7,30.16 52.7,30.48 | 70.8,39.69 IC6.8 IC6.7 | C12.1 52.7,33.02 | C13.1 66.36,43.78 66.36,44.13 | 72.49,36.93 72.55,36.99 | R32.1 81.86,39.05 85.88,39.05 86.36,39.53 86.36,45.24 87.95,46.83 90.81,46.83 92.55,45.09 92.55,41.43 93.82,40.16 97.63,40.16 98.42,39.37 98.42,36.04 97.79,35.4 94.83,35.4
  Top 0.61: J1.2 7.62,12.06 11.43,8.26 T1.2 13.02,8.26 13.34,7.94 19.41,7.94 X2.2 | 66.36,44.13 70.8,39.69 71.44,39.05 71.44,37.15 71.6,36.99 72.55,36.99 75.09,36.99 76.2,38.1 76.2,42.23 75.56,42.86 75.56,52.39 SV4.12 | v91.44,37.78 93.03,37.78 94.3,36.51 LED1.C 94.83,35.4 LED2.C LED4.C LED3.C | C9.1 72.49,36.93
  Top 0.813: 66.36,44.13 64.77,45.72 53.98,45.72 53.34,45.09 v53.34,44.13 | 52.7,43.81 52.39,43.81 v52.07,44.13
  Top 1.016: 52.7,30.48 52.7,33.02 52.7,43.81
  Top 1.27: 53.02,44.13 v53.34,44.13 v52.07,44.13 v50.8,44.13 | 53.02,44.13 53.34,43.81 | 52.7,43.81 53.02,44.13
  Top 1.422: C7.- 53.66,44.13 | 53.66,44.13 v53.34,44.13 53.34,43.81 | 53.34,43.81 55.24,41.91 D1.A | C6.- 50.48,41.59 52.7,43.81 | 53.34,43.81 53.66,44.13
  Bottom 0.305: C11.1 49.94,30.15 | 69.75,34.19 C8.1
  Bottom 0.406: 70.48,33.97 70.38,33.97 | 70.48,33.97 71.44,33.97 71.91,33.5 IC5.29 78.89,33.5 79.69,32.7 IC5.6 89.85,32.7 | 70.48,33.97 70.17,34.29 | 69.75,34.19 69.22,33.66 69.22,28.26 68.05,27.09 R13.2 | 55.56,29.53 54.93,30.16 52.7,30.16 52.7,30.15 IC7.4 49.94,30.15 | 70.38,34.29 C8.1
  Bottom 0.61: SV2.2 5.71,27.76 2.72,24.77 2.72,13.34 3.98,12.07 3.98,12.06 J1.2 | SV3.4 61.28,21.27 | SV3.2 61.28,21.27 | 61.28,21.27 55.56,21.27 | 39.7,12.71 39.69,12.7 | TP2.TP 35.88,12.7 | 35.56,17.78 35.56,18.41 | SV1.10 69.22,5.08 69.85,4.45 80.64,4.45 81.6,5.4 81.6,15.88 89.85,24.13 89.85,32.7 89.85,37.15 90.49,37.78 v91.44,37.78 | 55.56,29.53 55.56,21.27 | R25.2 65.41,6.35 65.72,6.03 | C15.- 44.13,12.38 44.45,12.7 | R28.2 52.74,10.44 52.86,10.32 | 55.56,21.27 53.98,21.27 52.07,19.37 52.07,17.14 50.48,15.56 50.48,12.7 | C8.1 70.48,33.97 | R13.2 66.14,25.08 C10.1 | D6.1 33.07,8.27 X1.2
  Bottom 0.813: SV2.2 SV2.4 SV2.6 SV2.8 | T3.2 35.39,22.69 35.56,22.86 | SV1.10 SV1.12 65.72,6.03 SV1.14 61.91,6.03 59.69,3.81 56.52,3.81 54.29,6.03 54.29,8.89 52.86,10.32 50.48,12.7 48.26,12.7 | 48.26,12.7 44.45,12.7 39.69,12.7 35.88,12.7 35.56,12.7 | SV4.14 SV4.12 SV4.10 | C16.1 48.36,12.8 48.26,12.7 | C17.1 8.47,12.06 J1.2 | C14.- 37.92,26.99 37.78,26.99
  Bottom 1.27: 35.56,12.7 35.56,17.78 35.56,22.86 35.56,24.13 37.78,26.35 37.78,26.99 37.78,31.11 v50.8,44.13 v53.34,44.13
  Bottom 1.422: 35.56,12.7 33.66,10.79 33.66,8.93 X1.2
  Bottom 2.184: X1.2 33.7,6.39 31.11,3.81 22.86,3.81 20.32,6.35 20.32,8.85 X2.2
GND1
  Top 0.813: U$1.P1_9 U$1.P5_7 U$1.P5_8
  Bottom 0.406: C1.2 33.11,40.22 IC1.4
  Bottom 0.61: C1.2 34.19,40.32 | C2.2 31.54,45.4 | 31.54,45.4 33.66,45.4 34.19,44.87 C4.1 34.29,42.23 C1.2 | 31.54,45.4 30.48,46.46 U$1.P5_8 | C1.2 C3.1 | SV5.3 97.47,54.61 96.84,53.98 90.81,53.98 89.22,55.56 86.78,55.56 R24.1 86.58,55.56 83.5,55.56 80.33,52.39 61.91,52.39 59.85,50.32 50.32,50.32 39.69,39.69 38.1,39.69
  Bottom 0.813: LCD1.GND_CON1@2 LCD1.GND_CON1@1 22.23,17.78 26.67,22.23 26.67,25.4 28.89,27.62 35.53,27.62 BAT1.- 35.56,34.61 38.1,37.15 38.1,39.69 37.57,40.22 C3.1
I2C_INT
  Top 0.61: SV2.10 5.71,40.01 9.84,44.13 9.84,55.39 Q3.3
  Bottom 0.61: R6.1 5.18,39.11 SV2.10
I2C_SCL  (via drill 0.8)
  Top 0.61: v19.37,34.92 18.1,34.92 17.46,34.29 11.75,34.29 | v53.02,56.52 53.02,49.21 54.93,47.31 v55.24,47.31 | SV2.1 9.53,28.57 11.75,30.8 11.75,34.29 | 11.75,34.29 11.75,38.88 Q2.3
  Bottom 0.406: v53.02,56.52 53.02,57.47 52.7,57.78 15.24,57.78 10.16,52.7 10.16,45.4 12.06,43.5 12.06,41.91 19.05,34.92 v19.37,34.92 | IC5.37 77.46,40.31 | 77.46,40.31 77.47,40.32 | 77.46,40.31 76.49,41.27 62.55,41.27 56.52,47.31 v55.24,47.31
  Bottom 0.61: R3.1 8.79,28.04 SV2.1
  Bottom 0.813: 8.15,28.47 SV2.1
I2C_SCL_RASP  (via drill 0.8)
  Top 0.61: v24.77,37.31 23.02,37.31 20,40.32
  Top 0.813: Q2.2 17.14,40.32 R2.1 19.9,40.22 20,40.32 21.27,41.59 21.27,50.48 U$1.P1_5
  Bottom 0.406: IC1.6 32.08,34.14 31.11,33.18 27.3,33.18 24.77,35.72 v24.77,37.31
I2C_SDA  (via drill 0.8)
  Top 0.61: v54.93,57.15 54.93,49.85 55.88,48.9 v60.96,48.9 | 11.75,43.5 11.43,43.5 v10.32,42.39 10.32,32.23 9.21,31.11 SV2.3
  Top 0.813: Q1.3 11.75,43.5
  Bottom 0.406: 10.26,31.75 R4.1 | v54.93,57.15 54.93,57.47 53.82,58.58 14.76,58.58 9.21,53.02 9.21,43.5 v10.32,42.39 | IC5.42 81.46,40.32 77.33,44.45 63.82,44.45 60.96,47.31 v60.96,48.9
  Bottom 0.813: R4.1 9.42,31.11 SV2.3
I2C_SDA_RASP
  Top 0.61: 17.05,44.45 R1.1
  Top 0.813: Q1.2 17.14,44.45 | 17.14,44.45 R1.1 | 17.14,44.45 18.41,44.45 19.37,45.4 19.37,51.12 U$1.P1_3
  Bottom 0.406: IC1.5 32.73,33.52 31.43,32.23 26.99,32.23 21.27,37.94 21.27,51.12 U$1.P1_3
MCLR  (via drill 0.8)
  Top 0.61: v68.58,13.34 68.58,17.78 v69.85,19.05
  Bottom 0.406: v69.85,19.05 71.75,19.05 78.26,25.55 IC5.18
  Bottom 0.61: SV3.6 61.28,16.51 64.56,13.23 R25.1 68.48,13.23
  Bottom 0.813: 68.48,13.23 v68.58,13.34
N$2
  Top 0.406: U$1.P1_7 25.4,52.39 24.45,53.34 16.19,53.34 15.77,53.76 R5.1
  Top 0.61: Q3.2 15.24,56.51 15.77,55.98 R5.1
N$5  (via drill 0.8)
  Top 0.61: U$1.P1_18 39.69,56.2 48.9,56.2 50.16,54.93 50.16,47.62 25.4,22.86 v19.37,22.86
  Bottom 0.61: v19.37,22.86 LCD1.A-LCD_LED
N$6  (via drill 0.8)
  Top 0.61: U$1.P1_16 38.42,57.47 49.53,57.47 51.44,55.56 51.44,46.99 26.04,21.59 v21.27,21.59
  Bottom 0.61: v21.27,21.59 14.61,21.59 LCD1.A-LCD_RST
N$7  (via drill 0.8)
  Top 0.61: U$1.P1_22 42.55,54.61 41.27,53.34 40.01,53.34 39.37,52.7 39.37,48.26 24.77,33.66 21.59,33.66 20.95,33.02 v19.37,33.02
  Bottom 0.61: v19.37,33.02 LCD1.ADS_IRQ
N$8
  Top 0.61: R7.1 35.56,56.52 37.47,58.42 99.38,58.42 100.01,57.78 SV5.4
N$9
  Bottom 0.61: R8.1 26.04,56.52 25.4,55.88 U$1.P1_8
N$10
  Bottom 0.61: R8.2 49.21,56.52 51.12,54.61 54.61,54.61 58.42,58.42 94.14,58.42 94.93,57.63 SV5.2
N$11  (via drill 0.8)
  Top 0.406: 55.24,31.75 55.22,31.75 IC2.8
  Top 1.422: L1.P$1 58.73,34.6 D1.C v55.24,32.7 55.24,31.75
  Bottom 0.813: C5.2 v55.24,32.7
N$12  (via drill 0.8)
  Top 0.61: v53.98,14.61 60.64,14.61 70.17,24.13 70.17,24.45 | 70.17,24.45 v70.17,26.67 | D3.3 70.17,24.45
  Bottom 0.406: IC5.7 79.22,31.9 78.42,32.7 IC5.28 70.7,32.7 C8.2
  Bottom 0.61: v70.17,26.67 70.17,32.17 C8.2 | D4.3 54.61,13.97 v53.98,14.61
N$13  (via drill 0.8)
  Top 0.406: v48.26,32.7 48.26,31.14 IC2.1
  Bottom 0.813: C5.1 v48.26,32.7
N$14
  Top 0.406: IC2.4 45.95,27.32 R9.1
N$15
  Bottom 0.406: IC5.17 79.06,25.08 72.07,18.1 71.44,18.1 70.48,17.14 | RN5.1 71.43,15.56 70.48,16.51 70.48,17.14 | 70.48,17.14 R11.2
  Bottom 0.61: R11.2 68.48,17.2
N$16  (via drill 0.8)
  Top 0.61: v70.17,14.92 71.75,14.92 72.39,15.56 v72.39,16.83
  Bottom 0.406: IC5.16 79.86,24.3 v72.39,16.83 72.31,16.75 RN5.2
  Bottom 0.61: R12.2 v70.17,14.92
N$17
  Bottom 0.406: IC1.1 30.8,39.81 30.8,38.52
  Bottom 0.61: Q4.1 28.89,40.01 28.89,39.05 29.27,38.52 30.8,38.52 C1.1
N$18
  Bottom 0.406: IC1.2 31.43,40.97 30.8,41.59 C2.1
  Bottom 0.61: C2.1 28.98,42.97 Q4.4
N$19
  Bottom 0.61: IC4.4 29.53,12.39 | 29.53,12.39 31.02,12.39 R16.1 | D6.3 29.53,12.39
  Bottom 0.813: T3.3 33.34,13.34 32.49,12.48 R16.1
N$20
  Bottom 0.61: 32.22,22.86 T3.1 30.52,22.69 R14.1
N$21
  Bottom 0.406: IC1.7 31.43,34.6 31.11,34.29 29.21,34.29 TP1.TP
N$22
  Bottom 0.406: RN5.3 73.11,15.64 80.64,23.18 80.64,26.89 IC5.15
N$23
  Top 0.61: T1.3 17.61,11.75 23.18,11.75 24.45,13.02 24.45,16.83 25.39,17.77 IC3.4 27.09,18.21 R18.1
N$24
  Top 0.61: T1.1 12.8,10.22 R17.1
N$25
  Bottom 0.406: IC5.14 81.46,22.72 73.98,15.24 RN5.4
N$26
  Bottom 0.406: IC5.11 84.77,28.62 84.77,24.77 75.88,15.87 RN4.1
N$27
  Bottom 2.184: X1.1 38.7,6.39 42.16,2.92 F1.1A
N$28
  Bottom 0.406: RN4.2 76.75,15.47 86.68,25.4 86.68,28.57 85.75,29.5 IC5.10
N$29
  Bottom 0.406: IC5.9 86.22,30.3 87.63,28.89 87.63,25.08 77.55,15.01 RN4.3
N$30
  Bottom 0.406: RN4.4 78.43,14.61 88.58,24.77 88.58,29.21 86.69,31.1 IC5.8
N$31
  Bottom 0.61: SV3.5 58.74,15.72 D4.1
N$32  (via drill 0.8)
  Top 0.61: v32.7,44.13 v32.7,46.99
  Bottom 0.406: IC1.3 32.08,41.81 C4.2
  Bottom 0.61: C4.2 32.49,43.87 v32.7,44.13 | v32.7,46.99 32.7,49.74 R19.2
N$33
  Bottom 0.61: D2.1 39.05,46.03 38.73,45.72 35.88,45.72 35.56,46.04 BAT1.+
N$34
  Bottom 0.61: R19.1 37.95,49.85 D2.3
N$35
  Bottom 0.61: R27.1 57.3,16.92 D7.3
N$36
  Bottom 0.61: R11.1 66.04,17.14 63.18,20 63.18,23.5 62.23,24.45 59.37,24.45 58.74,23.81 SV3.1
N$37
  Bottom 0.61: R12.1 65.41,14.92 64.14,16.19 64.14,17.14 62.55,18.73 60.01,18.73 SV3.3
N$38
  Top 0.406: IC6.1 69.53,48.58 67.94,50.16 67.94,52.39 SV4.4
N$39
  Top 0.406: IC6.2 69.22,47.31 66.67,49.85 SV4.3
N$40
  Top 0.406: IC6.4 70.17,44.77 65.41,49.53 65.41,52.39 SV4.2
N$41
  Top 0.406: IC6.5 69.85,43.5 64.14,49.21 SV4.1
N$42
  Top 0.406: IC6.15 80.64,47.31 81.6,48.26 81.6,53.98 80.64,54.93 73.34,54.93 73.03,54.61 73.03,52.39 SV4.7
N$43
  Top 0.406: IC6.14 80.64,46.04 82.55,47.94 82.55,54.61 81.28,55.88 73.03,55.88 71.75,54.61 SV4.8
N$44
  Top 0.406: IC6.12 82.23,43.5 88.27,49.53 88.27,53.5 85.09,56.67 72.39,56.67 70.48,54.77 70.48,52.39 SV4.5
N$45
  Top 0.406: IC6.11 82.07,42.23 89.22,49.37 89.22,53.82 85.57,57.47 72.07,57.47 69.22,54.61 SV4.6
N$46  (via drill 0.8)
  Top 0.406: IC6.10 82.87,40.96 84.45,42.55 v85.25,42.55
  Bottom 0.406: IC5.3 85.9,35.1 87.31,36.51 87.31,40.48 v85.25,42.55
N$47  (via drill 0.8)
  Top 0.406: IC6.9 84.3,39.69 v85.25,40.64
  Bottom 0.406: IC5.2 85.75,35.9 86.36,36.51 86.36,39.53 v85.25,40.64
N$48  (via drill 0.8)
  Top 0.406: IC6.6 74.61,42.23 75.25,41.59 75.25,39.05 74.61,38.42 v73.03,38.42
  Bottom 0.406: IC5.32 73.23,35.88 71.75,35.88 71.44,36.2 71.44,38.1 71.75,38.42 v73.03,38.42
N$49
  Bottom 0.406: IC7.6 59.69,28.89 65.41,23.18 65.94,23.18 C10.2
  Bottom 0.61: TP8.TP C10.2 66.14,23.18 R15.2
N$50
  Bottom 0.406: R15.1 70.7,23.18 74.42,26.9 IC5.22
N$51
  Bottom 0.406: 75.88,26.93 IC5.21 75.86,27.91 75.88,27.94 75.56,28.26 74.61,28.26 71.44,25.08 R13.1
N$52  (via drill 0.8)
  Top 0.406: IC6.13 81.6,44.77 v83.5,46.67
  Top 0.61: R21.1 77.47,21.59 78.11,22.23 78.11,28.89 87.47,38.42 v87.47,42.55
  Bottom 0.406: v87.47,42.55 87.47,42.7 v83.5,46.67
N$53  (via drill 0.8)
  Top 0.406: v70.8,46.04 IC6.3
  Top 0.61: R20.1 75.88,28.89 v84.93,37.94
  Bottom 0.61: v84.93,37.94 84.93,38.89 77.79,46.04 v70.8,46.04
N$54
  Top 0.61: LED1.A 96.94,38.22 R22.2
N$55
  Top 0.61: R23.2 98.42,26.67 99.85,28.1 99.85,32.7 98.42,34.13 LED2.A
N$56
  Bottom 0.61: U$1.P1_10 29.21,53.34 54.93,53.34 58.95,57.37 R24.2 87.57,57.47 88.37,57.47 R10.1
N$57
  Bottom 0.61: R10.2 91.44,57.15 SV5.1
N$58  (via drill 0.8)
  Top 0.61: R26.1 73.5,25.4 61.59,13.34 v52.39,13.34
  Bottom 0.61: R28.1 53.94,11.78 v52.39,13.34 52.39,15.24 53.5,16.35 R27.2
N$59
  Bottom 0.406: IC5.4 86.37,34.3 88.27,36.2 88.27,39.69 90.17,41.59 R29.2
N$60  (via drill 0.8)
  Top 0.61: 76.14,33.81 R31.1 | R32.2 R31.1 | R31.1 76.2,31.91 75.09,30.8 v71.44,30.8
  Bottom 0.406: IC5.26 71.9,31.1 v71.44,30.8
N$61
  Bottom 0.406: IC5.5 87.16,33.5 88.9,35.24 88.9,39.05 89.53,39.69 R30.2
N$62  (via drill 0.8)
  Top 0.61: v98.42,29.37 LED3.A
  Bottom 0.61: v98.42,29.37 99.38,29.37 99.69,29.69 99.69,35.88 93.98,41.59 R29.1
N$63  (via drill 0.8)
  Top 0.61: v98.42,31.43 LED4.A
  Bottom 0.61: v98.42,31.43 98.42,35.24 93.98,39.69 R30.1
RB0
  Bottom 0.406: SV1.1 79.38,9.53 78.42,10.48 RN4.5
RB1
  Bottom 0.406: SV1.2 78.11,7.3 78.11,9.53 77.55,10.08 RN4.6
RB2
  Bottom 0.406: RN4.7 76.75,9.61 76.83,9.53 SV1.3
RB3
  Bottom 0.406: SV1.4 75.56,7.3 75.56,9.84 75.88,10.15 RN4.8
RB4
  Bottom 0.406: RN5.5 73.98,10.15 74.3,9.84 SV1.5
RB5
  Bottom 0.406: SV1.6 73.11,7.22 RN5.6
RB6
  Bottom 0.406: RN5.7 72.31,10.08 71.75,9.53 SV1.7
RB7
  Bottom 0.406: SV1.8 70.48,7.3 70.48,9.84 71.43,10.79 RN5.8
SPC_5V  (via drill 0.8)
  Top 0.61: R17.2 22.23,12.7 22.86,13.34 22.86,19.37 24.13,20.64 27.3,20.64 32.38,25.72 36.83,25.72 40.01,28.89 v40.01,30.8
  Bottom 0.406: IC5.39 79.06,41.27 77.15,43.18 63.5,43.18 57.15,49.53 54.29,49.53 53.02,48.26 53.02,46.35 54.61,44.77 54.61,42.55 53.66,41.59
  Bottom 0.61: 53.66,41.59 50.48,41.59 40.01,31.11 v40.01,30.8
SPC_V+  (via drill 0.8)
  Top 0.61: v42.23,30.8 42.23,28.89 37.78,24.45 v33.34,24.45
  Bottom 0.406: IC5.38 78.26,40.8 76.83,42.23 63.18,42.23 56.83,48.58 54.61,48.58 53.98,47.94 53.98,46.67 55.56,45.09 55.56,42.23 53.66,40.32
  Bottom 0.61: 53.66,40.32 51.12,40.32 42.23,31.43 v42.23,30.8 | v33.34,24.45 30.58,24.45 R14.2
SPI_CE0  (via drill 0.8)
  Top 0.61: U$1.P1_24 44.45,53.34 42.55,53.34 41.91,52.7 41.91,46.99 25.4,30.48 v19.37,30.48
  Bottom 0.61: v19.37,30.48 LCD1.A-ADS_CS
SPI_CE1  (via drill 0.8)
  Top 0.61: U$1.P1_26 46.99,53.34 46.99,46.35 26.04,25.4 v19.37,25.4
  Bottom 0.61: v19.37,25.4 LCD1.A-LCD_CS
SPI_MISO  (via drill 0.8)
  Top 0.61: U$1.P1_21 43.18,46.35 24.77,27.94 v19.37,27.94
  Bottom 0.61: v19.37,27.94 LCD1.SDO
SPI_MOSI  (via drill 0.8)
  Top 0.61: U$1.P1_19 40.64,47.62 25.08,32.07 v23.02,32.07
  Bottom 0.61: v23.02,32.07 23.02,25.4 21.75,24.13 14.61,24.13 LCD1.A-SDI
SPI_SCLK  (via drill 0.8)
  Top 0.61: U$1.P1_23 45.72,46.99 25.4,26.67 v21.27,26.67
  Bottom 0.61: v21.27,26.67 14.61,26.67 LCD1.A-SCL
V+  (via drill 0.8)
  Top 0.61: 31.34,18.2 31.11,18.41 | D5.A 53.5,20.15 v53.5,18.41
  Top 1.422: D5.A 52.02,20.31 F1.2A
  Top 1.93: v31.11,16.19 v31.11,17.78 31.11,18.41 v31.11,19.37 33.97,22.23 38.73,22.23 40.26,23.75 F1.2A
  Bottom 0.406: 48.83,23.81 F1.2A
  Bottom 0.61: v31.11,16.19 IC4.1 | IC4.2 31.11,14.93 31.11,14.92 | IC4.3 29.54,13.66 29.84,13.97 30.9,13.97 R16.2 | TP7.TP v31.11,19.37 | D7.1 53.97,17.94 v53.5,18.41
  Bottom 1.27: R16.2 31.11,14.92 v31.11,16.19 v31.11,17.78 v31.11,19.37
VCC/2  (via drill 0.8)
  Top 0.406: IC2.3 45.92,28.59 R9.2
  Top 0.61: IC2.2 48.27,29.84 45.72,29.84
  Top 0.813: R9.2 45.72,29.84 v45.72,30.96 v45.72,32.23 45.72,32.38 47.62,34.29 50.48,34.29 | 50.48,34.29 50.9,33.87 | 50.48,34.29 50.32,34.45
  Top 1.016: C12.2 50.9,33.87 | 50.32,34.45 50.32,35.54 C6.+
  Top 1.422: C12.2 50.9,26.89 52.38,25.41 D5.C
  Bottom 0.305: C11.2 49.96,27.61
  Bottom 0.406: 49.96,27.61 IC7.2
  Bottom 0.61: 45.72,28.1 49.47,28.1 C11.2
  Bottom 0.813: C14.+ 44.29,26.67 45.72,28.1 v45.72,30.96 v45.72,32.23
VDD  (via drill 0.8)
  Top 0.61: v61.59,12.06 71.44,12.06 79.69,20.32 79.69,28.57 88.58,37.47 v88.58,45.56 90.36,45.56 91.44,44.49 91.44,40.96 93.98,38.42 R22.1
  Top 0.813: X2.1 27.94,8.89 31.11,12.06 v61.59,12.06
  Bottom 0.305: SJ1.2 SJ1.1 | SJ3.1 SJ3.2
  Bottom 0.406: SJ2.1 SJ2.2
  Bottom 0.61: SV2.9 8.26,40.64 7.3,41.59 2.54,41.59 1.59,40.64 1.59,12.7 4.13,10.16 SJ1.2 | SJ1.1 13.97,10.16 16.19,12.38 IC4.5 25.36,12.38 | IC4.8 25.04,16.19 25.36,15.88 | IC4.7 25.36,14.92 | IC4.6 25.36,13.65 | v88.58,45.56 88.58,47.31 SJ3.2 | TP6.TP 60.01,12.06 v61.59,12.06 | SJ3.1 85.72,50.16 80.33,50.16 SV4.13
  Bottom 0.813: SV1.13 61.78,8.57 SJ2.2 | v61.59,12.06 SJ2.1
  Bottom 1.93: X2.1 25.36,12.38 25.36,13.65 25.36,14.92 25.36,15.88

### Text on the board
Top: PWR | +5V | INFO | STAT | PointhiBoard | V1.40
tNames: PWR | +5V | INFO | STAT | PointhiBoard | V1.40